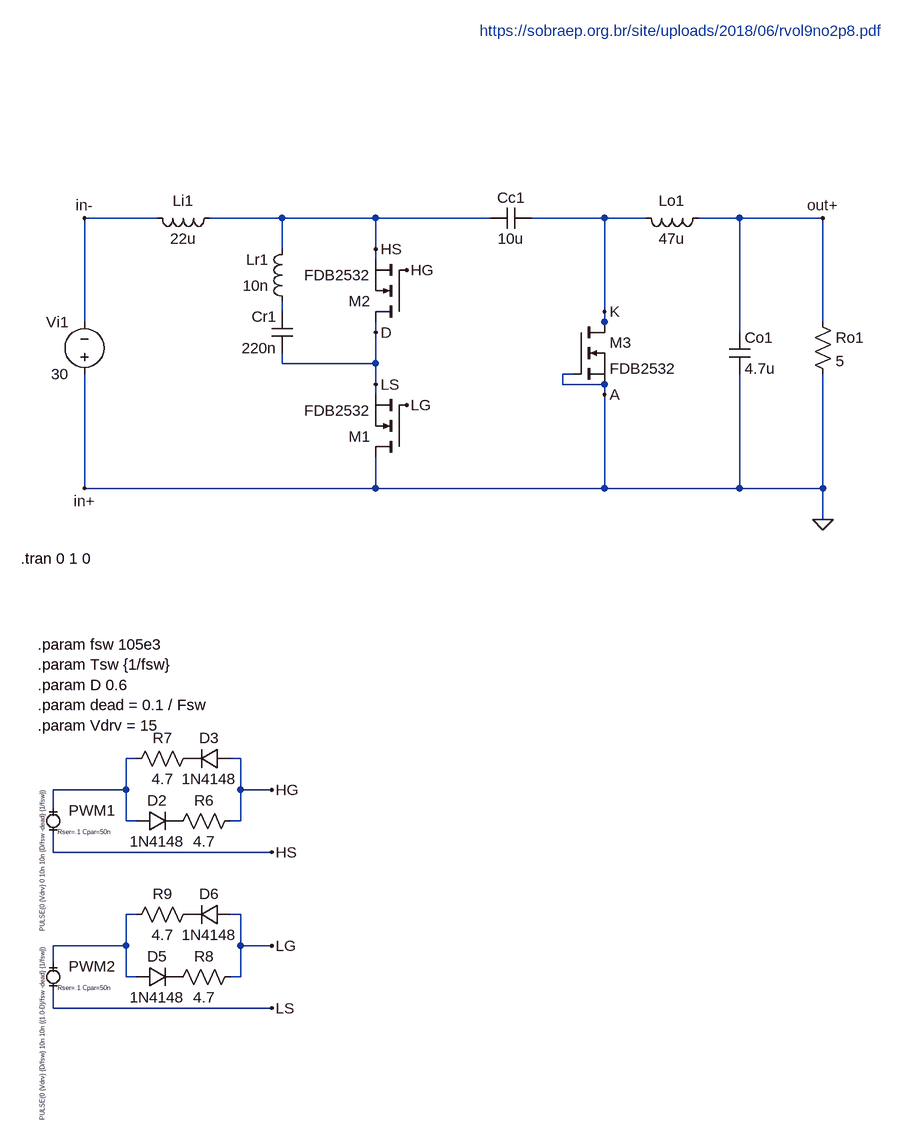
[diagram p0: schematic cuk_soft_actv_clmp.asc]
cuk_soft_actv_clmp.asc, the LTspice schematic file:
Version 4
SHEET 1 880 1456
WIRE -256 64 -368 64
WIRE -64 64 -176 64
WIRE 80 64 -64 64
WIRE 256 64 80 64
WIRE 432 64 320 64
WIRE 496 64 432 64
WIRE 640 64 576 64
WIRE 768 64 640 64
WIRE -64 112 -64 64
WIRE 80 112 80 64
WIRE 80 128 80 112
WIRE -64 208 -64 192
WIRE 432 208 432 64
WIRE -368 224 -368 64
WIRE 432 224 432 208
WIRE 768 224 768 64
WIRE 80 240 80 224
WIRE 432 240 432 224
WIRE 640 240 640 64
WIRE -64 288 -64 272
WIRE 80 288 80 240
WIRE 80 288 -64 288
WIRE 384 304 368 304
WIRE 80 320 80 288
WIRE 368 320 368 304
WIRE 432 320 432 304
WIRE 432 320 368 320
WIRE 80 336 80 320
WIRE 432 336 432 320
WIRE -368 480 -368 304
WIRE 80 480 80 432
WIRE 80 480 -368 480
WIRE 432 480 432 336
WIRE 432 480 80 480
WIRE 640 480 640 304
WIRE 640 480 432 480
WIRE 768 480 768 304
WIRE 768 480 640 480
WIRE 768 528 768 480
WIRE -288 896 -304 896
WIRE -128 896 -144 896
WIRE -304 944 -304 896
WIRE -304 944 -416 944
WIRE -128 944 -128 896
WIRE -80 944 -128 944
WIRE -416 976 -416 944
WIRE -304 992 -304 944
WIRE -288 992 -304 992
WIRE -128 992 -128 944
WIRE -128 992 -144 992
WIRE -416 1040 -416 1008
WIRE -80 1040 -416 1040
WIRE -288 1136 -304 1136
WIRE -128 1136 -144 1136
WIRE -304 1184 -304 1136
WIRE -304 1184 -416 1184
WIRE -128 1184 -128 1136
WIRE -80 1184 -128 1184
WIRE -416 1216 -416 1184
WIRE -304 1232 -304 1184
WIRE -288 1232 -304 1232
WIRE -128 1232 -128 1184
WIRE -128 1232 -144 1232
WIRE -416 1280 -416 1248
WIRE -80 1280 -416 1280
FLAG 432 336 A
FLAG 128 144 HG
FLAG 432 208 K
FLAG 80 112 HS
FLAG 80 240 D
FLAG 768 528 0
FLAG 768 64 out+
FLAG -368 480 in+
FLAG -368 64 in-
FLAG -80 1280 LS
FLAG -80 944 HG
FLAG -80 1040 HS
FLAG -80 1184 LG
FLAG 128 352 LG
FLAG 80 320 LS
SYMBOL voltage -368 320 R180
WINDOW 0 24 96 Left 2
WINDOW 3 24 16 Left 2
SYMATTR InstName Vi1
SYMATTR Value 30
SYMBOL ind -160 48 R90
WINDOW 0 5 56 VBottom 2
WINDOW 3 32 56 VTop 2
SYMATTR InstName Li1
SYMATTR Value 22u
SYMBOL ind 592 48 R90
WINDOW 0 5 56 VBottom 2
WINDOW 3 32 56 VTop 2
SYMATTR InstName Lo1
SYMATTR Value 47u
SYMBOL cap -48 272 R180
WINDOW 0 24 56 Left 2
WINDOW 3 24 8 Left 2
SYMATTR InstName Cr1
SYMATTR Value 220n
SYMBOL ind -48 208 R180
WINDOW 0 36 80 Left 2
WINDOW 3 36 40 Left 2
SYMATTR InstName Lr1
SYMATTR Value 10n
SYMBOL cap 320 48 R90
WINDOW 0 0 32 VBottom 2
WINDOW 3 32 32 VTop 2
SYMATTR InstName Cc1
SYMATTR Value 10u
SYMBOL cap 624 240 R0
SYMATTR InstName Co1
SYMATTR Value 4.7u
SYMBOL res 752 208 R0
SYMATTR InstName Ro1
SYMATTR Value 5
SYMBOL nmos 128 224 R180
SYMATTR InstName M2
SYMATTR Value FDB2532
SYMBOL nmos 384 224 R0
SYMATTR InstName M3
SYMATTR Value FDB2532
SYMBOL nmos 128 432 R180
SYMATTR InstName M1
SYMATTR Value FDB2532
SYMBOL MiniSyms4\\voltage- -416 992 R0
WINDOW 3 -17 -49 VRight 0
WINDOW 123 0 0 Left 0
WINDOW 39 7 17 Left 0
SYMATTR Value PULSE(0 {Vdrv} 0 10n 10n {D/fsw -dead} {1/fsw})
SYMATTR SpiceLine Rser=.1 Cpar=50n
SYMATTR InstName PWM1
SYMBOL MiniSyms4\\voltage- -416 1232 R0
WINDOW 3 -17 -49 VRight 0
WINDOW 123 0 0 Left 0
WINDOW 39 7 17 Left 0
SYMATTR Value PULSE(0 {Vdrv} {D/fsw} 10n 10n {(1.0-D)/fsw -dead} {1/fsw})
SYMATTR SpiceLine Rser=.1 Cpar=50n
SYMATTR InstName PWM2
SYMBOL diode -288 1008 R270
WINDOW 0 32 32 VTop 2
WINDOW 3 0 32 VBottom 2
SYMATTR InstName D2
SYMATTR Value 1N4148
SYMBOL diode -144 880 R90
WINDOW 0 0 32 VBottom 2
WINDOW 3 32 32 VTop 2
SYMATTR InstName D3
SYMATTR Value 1N4148
SYMBOL res -128 976 R90
WINDOW 0 0 56 VBottom 2
WINDOW 3 32 56 VTop 2
SYMATTR InstName R6
SYMATTR Value 4.7
SYMBOL res -192 880 R90
WINDOW 0 0 56 VBottom 2
WINDOW 3 32 56 VTop 2
SYMATTR InstName R7
SYMATTR Value 4.7
SYMBOL diode -288 1248 R270
WINDOW 0 32 32 VTop 2
WINDOW 3 0 32 VBottom 2
SYMATTR InstName D5
SYMATTR Value 1N4148
SYMBOL diode -144 1120 R90
WINDOW 0 0 32 VBottom 2
WINDOW 3 32 32 VTop 2
SYMATTR InstName D6
SYMATTR Value 1N4148
SYMBOL res -128 1216 R90
WINDOW 0 0 56 VBottom 2
WINDOW 3 32 56 VTop 2
SYMATTR InstName R8
SYMATTR Value 4.7
SYMBOL res -192 1120 R90
WINDOW 0 0 56 VBottom 2
WINDOW 3 32 56 VTop 2
SYMATTR InstName R9
SYMATTR Value 4.7
TEXT 240 -224 Left 2 ;https://sobraep.org.br/site/uploads/2018/06/rvol9no2p8.pdf
TEXT -440 720 Left 2 !.param fsw 105e3\n.param Tsw {1/fsw}\n.param D 0.6\n.param dead = 0.1 / Fsw\n.param Vdrv = 15
TEXT -466 588 Left 2 !.tran 0 1 0

The netlist it stands for:
* cuk_soft_actv_clmp.asc
Vi1 0 in- 30
Li1 HS in- 22u
Lo1 out+ K 47u
Cr1 LS N001 220n
Lr1 N001 HS 10n
Cc1 K HS 10u
Co1 out+ 0 4.7u
Ro1 out+ 0 5
M2 LS HG HS HS FDB2532
M3 K 0 0 0 FDB2532
M1 0 LG LS LS FDB2532
V§PWM1 N002 HS PULSE(0 {Vdrv} 0 10n 10n {D/fsw -dead} {1/fsw}) Rser=.1 Cpar=50n
V§PWM2 N003 LS PULSE(0 {Vdrv} {D/fsw} 10n 10n {(1.0-D)/fsw -dead} {1/fsw}) Rser=.1 Cpar=50n
D2 N002 P001 1N4148
D3 HG P002 1N4148
R6 HG P001 4.7
R7 P002 N002 4.7
D5 N003 P003 1N4148
D6 LG P004 1N4148
R8 LG P003 4.7
R9 P004 N003 4.7
.model D D
.lib standard.dio
.model NMOS NMOS
.model PMOS PMOS
.lib standard.mos
* https://sobraep.org.br/site/uploads/2018/06/rvol9no2p8.pdf
.param fsw 105e3
.param Tsw {1/fsw}
.param D 0.6
.param dead = 0.1 / Fsw
.param Vdrv = 15
.tran 0 1 0
.backanno
.end